# EasyEDA Pro project bitMan_Schematic_2025-12-16.epro

# Schematic Top
Board Name: Board1; Create Date: 2025-11-07; Page Name: Top; Project Name: BitTree; Schematic Name: Top; Update Date: 2025-11-18; Company: bitaggregat.de; Drawn: TR; Page Size: A4; Reviewed: TR; Version: V1.0
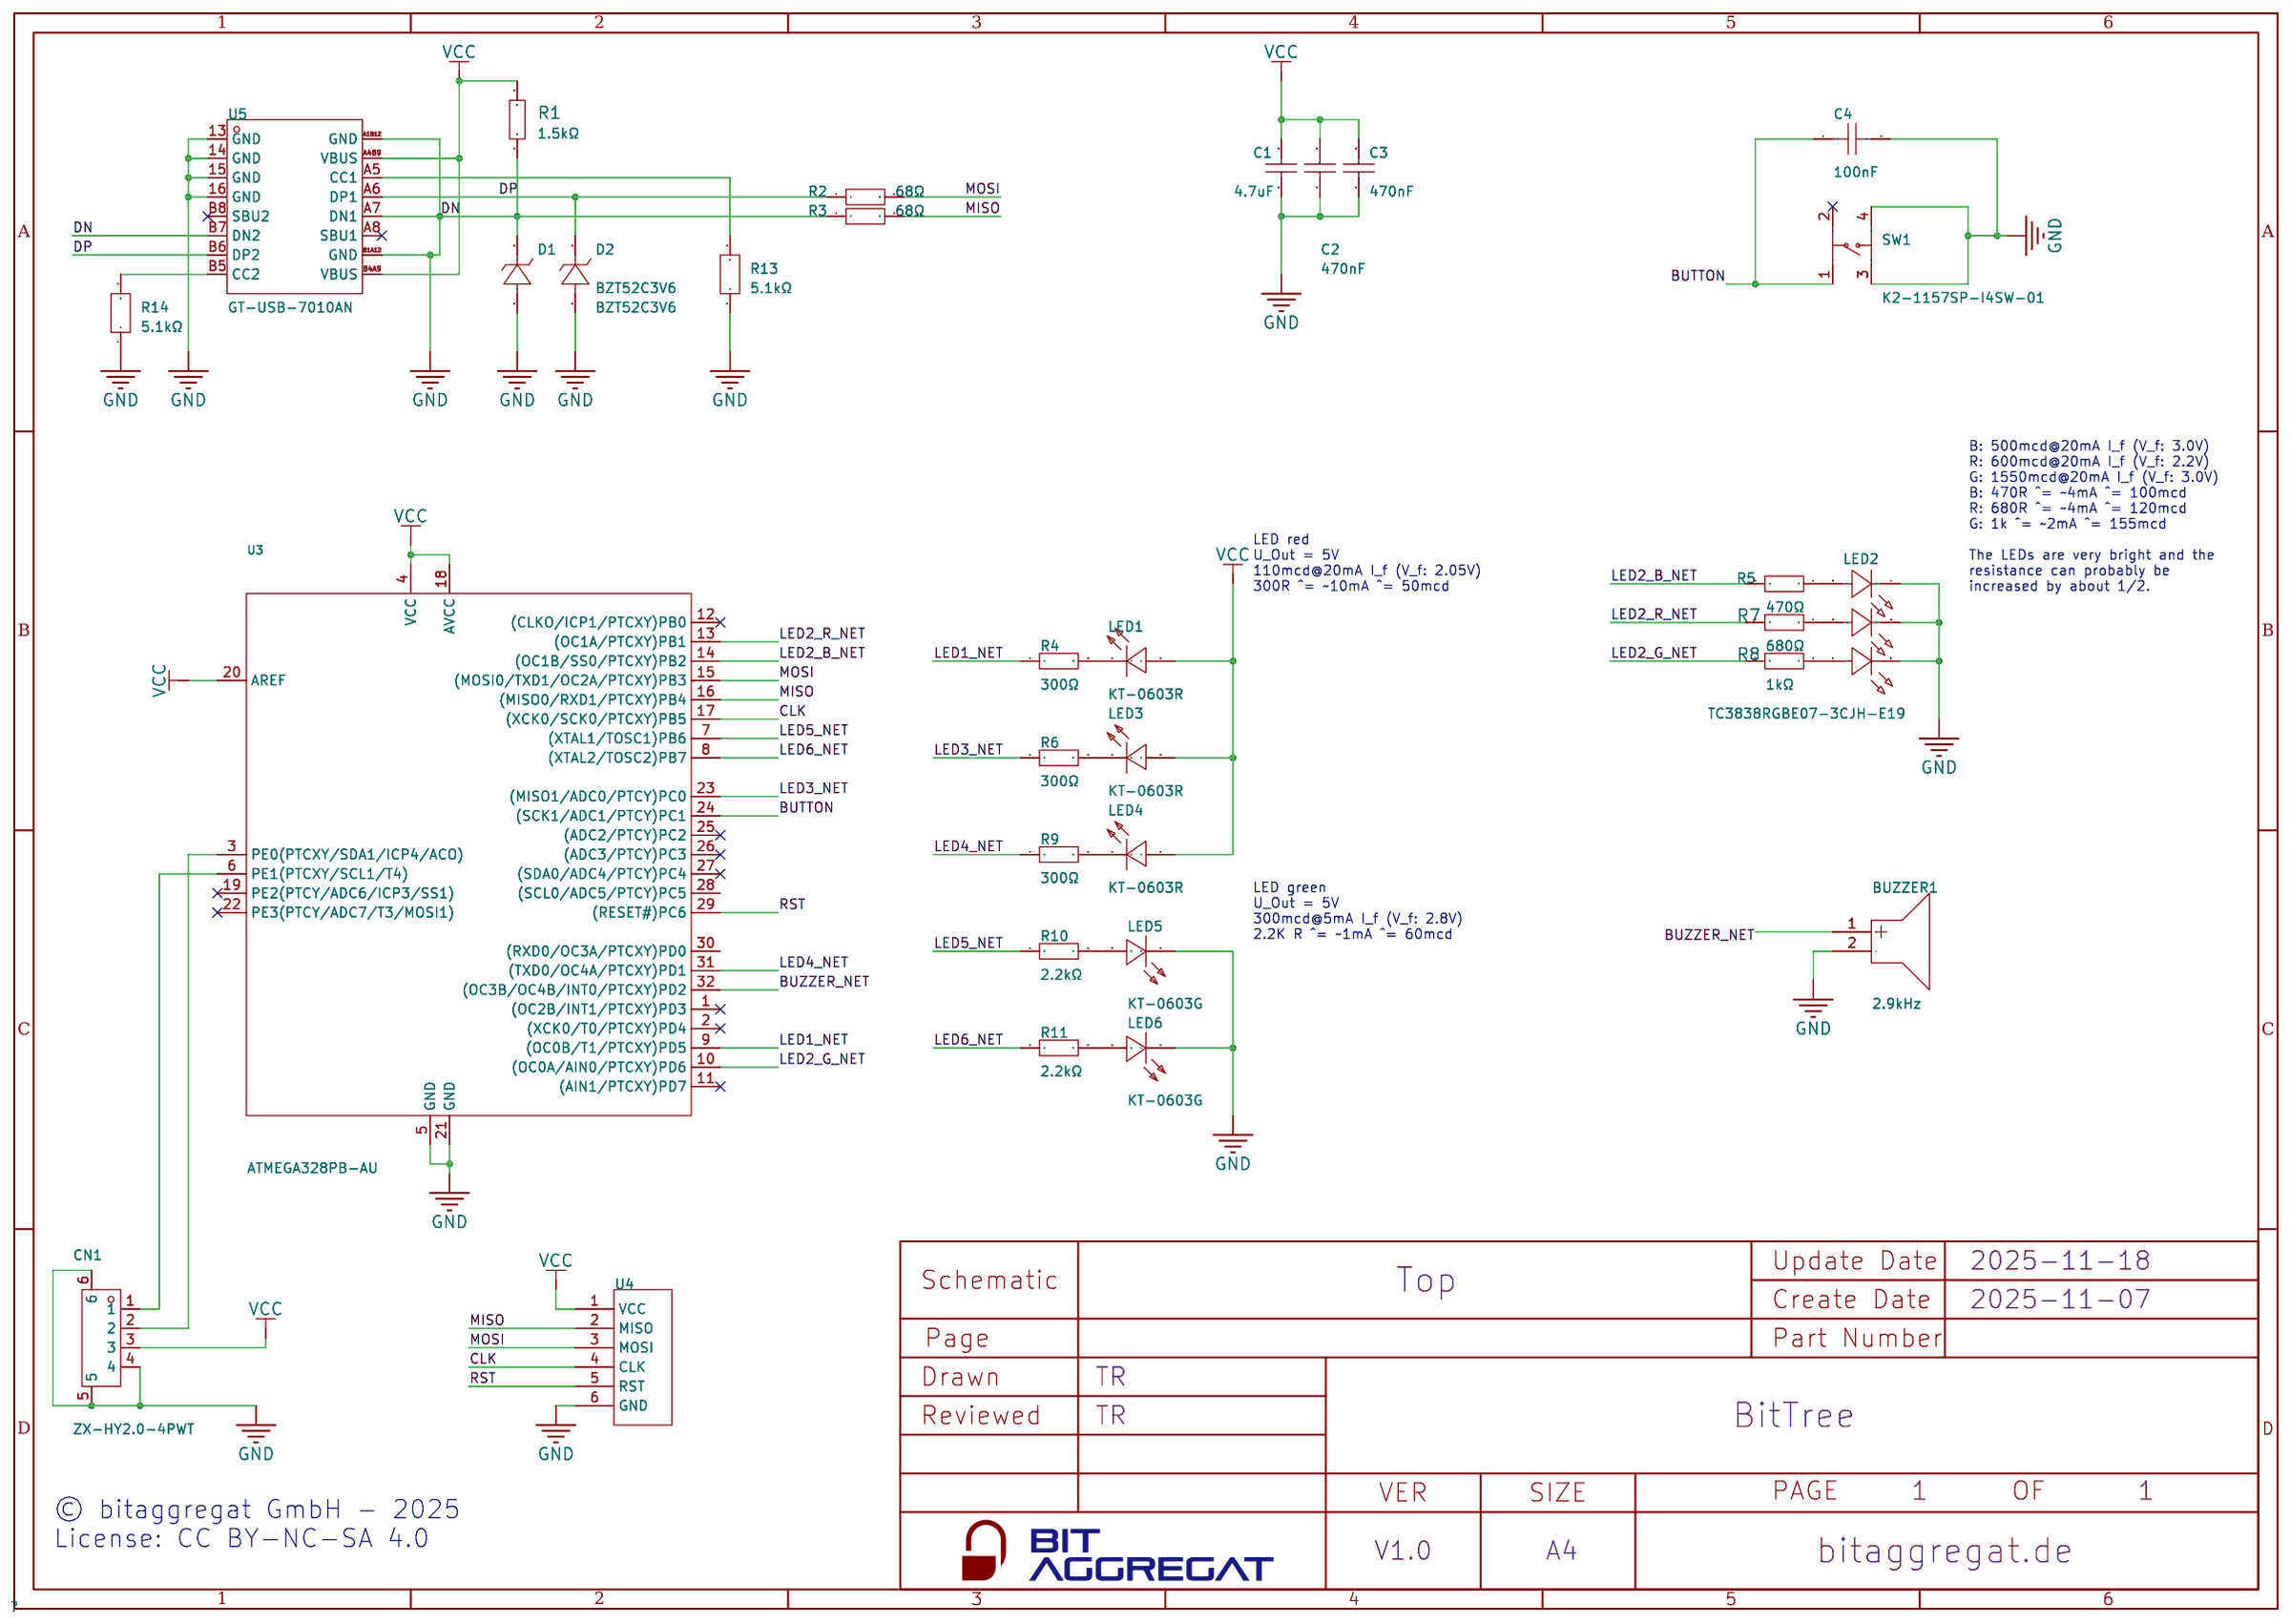
[diagram p0: schematic sheet]

## Parts
BUZZER1  2.9kHz  [BUZ-TH_BD9.0-P5.00-D0.6-L-FD]
C1  4.7uF  [C0603]
C2  470nF  [C0603]
C3  470nF  [C0603]
C4  100nF  [C0603]
CN1  ZX-HY2.0-4PWT  [CONN-SMD_4P-P2.00_ZX-HY2.0-4PWT]
D1  BZT52C3V6  [SOD-123_L2.7-W1.6-LS3.7-RD]
D2  BZT52C3V6  [SOD-123_L2.7-W1.6-LS3.7-RD]
LED1  KT-0603R  [LED0603-RD]
LED2  TC3838RGBE07-3CJH-E19  [LED-SMD_6P-L3.5-W3.5-BL]
LED3  KT-0603R  [LED0603-RD]
LED4  KT-0603R  [LED0603-RD]
LED5  KT-0603G  [LED0603-RD]
LED6  KT-0603G  [LED0603-RD]
R1  1.5kΩ  [R0603]
R2  68Ω  [R0603]
R3  68Ω  [R0603]
R4  300Ω  [R0603]
R5  470Ω  [R0603]
R6  300Ω  [R0603]
R7  680Ω  [R0603]
R8  1kΩ  [R0603]
R9  300Ω  [R0603]
R10  2.2kΩ  [R0603]
R11  2.2kΩ  [R0603]
R13  5.1kΩ  [R0603]
R14  5.1kΩ  [R0603]
SW1  K2-1157SP-I4SW-01  [SW-SMD_4P-L6.2-W6.2-P4.50-LS8.6]
U3  ATMEGA328PB-AU  [TQFP-32_L7.0-W7.0-P0.80-LS9.0-BL]
U4  -  [ProgrammingHeader]  (no BOM)
U5  GT-USB-7010AN  [USB-SMD_GT-USB-7010AN]

## Library data of the parts
BUZZER1 = Cy-9055-5029: Oscillator Circuit:有源(内含驱动线路) Technology Type:电磁式 Operating Voltage:4V~7V Operating Voltage:4V~7V Frequency:2.9kHz Sound Pressure Level (SPL):85dB@5V,10cm Diameter (φD):9mm Height:6mm; LCSC Part Name: 电磁式有源蜂鸣器; Supplier Part: C200211; Manufacturer: CY(超音); Supplier Footprint: 插件,D=9mm; JLCPCB Part Class: Extended Part; Datasheet: https://atta.szlcsc.com/upload/public/pdf/source/20180420/C200211_A81316451996AD52A4D9A06CCBA2DFC8.pdf; Supplier: LCSC; Oscillator Circuit: 有源(内含驱动线路); Technology Type: 电磁式; Operating Voltage: 4V~7V; Sound Pressure Level (SPL): 85dB@5V,10cm; Diameter (φD): 9mm; Height: 6mm
C1 = CL10A475KO8NNNC: Capacitance: Tolerance:±10% Tolerance:±10% Voltage Rated: Temperature Coefficient:; LCSC Part Name: 4.7uF ±10% 16V; Supplier Part: C19666; Manufacturer: SAMSUNG(三星); Supplier Footprint: 0603; JLCPCB Part Class: Basic Part; Datasheet: https://atta.szlcsc.com/upload/public/pdf/source/20160218/1457707763339.pdf; Supplier: LCSC; Tolerance: ±10%
C2 C3 = CL10B474KA8NNNC: Capacitance: Tolerance:±10% Tolerance:±10% Voltage Rated: Temperature Coefficient:; LCSC Part Name: 470nF ±10% 25V; Supplier Part: C1623; Manufacturer: SAMSUNG(三星); Supplier Footprint: 0603; JLCPCB Part Class: Basic Part; Datasheet: https://atta.szlcsc.com/upload/public/pdf/source/20160218/1457707763339.pdf; Supplier: LCSC; Tolerance: ±10%
C4 = CC0603KRX7R9BB104: Capacitance:100nF Tolerance:±10% Tolerance:±10% Voltage Rating:50V Temperature Coefficient:X7R; LCSC Part Name: 100nF ±10% 50V; Supplier Part: C14663; Manufacturer: YAGEO(国巨); Supplier Footprint: 0603; JLCPCB Part Class: Basic Part; Datasheet: https://item.szlcsc.com/datasheet/CC0603KRX7R9BB104/15331.html; Supplier: LCSC; Tolerance: ±10%; Voltage Rating: 50V; Temperature Coefficient: X7R
CN1 = ZX-HY2.0-4PWT: Pins Structure:1x4P Pitch:2mm Mounting Type:Surface Mount, Right Angle Reference Series:HY Number of Pins:4P Number of Rows:1 Number of PINs Per Row:4 Row Spacing:- Current Rating:2A Contact Material:Brass Contact Plating:Tin Operating Temperature:-25℃~+8; LCSC Part Name: 1x4P 间距:2mm 卧贴 系列:HY; Supplier Part: C7429571; Manufacturer: Megastar(兆星); Supplier Footprint: SMD,P=2mm,卧贴; JLCPCB Part Class: Extended Part; Datasheet: https://item.szlcsc.com/datasheet/ZX-HY2.0-4PWT/8427488.html; Supplier: LCSC; Pins Structure: 1x4P; Pitch: 2mm; Mounting Type: Surface Mount, Right Angle; Reference Series: HY; Number of Pins: 4P; Number of Rows: 1; Number of PINs Per Row: 4; Current Rating: 2A; Contact Material: Brass; Contact Plating: Tin; Operating Temperature: -25℃~+85℃; Supplementary Features: Auxiliary Solder Pin; Color: Beige; Z-Height of the Board: 5.2mm; X-Length of Bottom Edge on Board (Spacing Line): 12mm; Y-Width of Bottom Edge on Board: 10.5mm
D1 D2 = BZT52C3V6_C19077397: Diode Configuration:Independent Zener Voltage(Nom):3.6V Reverse Leakage Current (Ir):5uA@1.0V Zener Voltage(Range):3.42V~3.78V Zener Voltage(Range):3.42V~3.78V Pd - Power Dissipation:350mW Impedance(Zzt):90Ω Impedance(Zzk):600Ω Operating Junction Temperat; LCSC Part Name: 表面贴装齐纳二极管; Supplier Part: C19077397; Manufacturer: R+O(宏嘉诚); Supplier Footprint: SOD-123; JLCPCB Part Class: Extended Part; Datasheet: https://item.szlcsc.com/datasheet/BZT52C3V6/20275482.html; Supplier: LCSC; Diode Configuration: Independent; Zener Voltage (Nom): 3.6V; Reverse Leakage Current (Ir): 5uA@1.0V; Zener Voltage (Range): 3.42V~3.78V; Power Dissipation: 500mW; Zener Impedance (Zzt): 90Ω; Zener Voltage(Nom): 3.6V; Zener Voltage(Range): 3.42V~3.78V; Pd - Power Dissipation: 350mW; Impedance(Zzt): 90Ω; Impedance(Zzk): 600Ω; Operating Junction Temperature Range: -55℃~+150℃
LED1 LED3 LED4 = KT-0603R: Emitted Color:Red Power Dissipation:- Forward Current:- Dominant Wavelength:- Dominant Wavelength:- Peak Wavelength:- Diode Configuration:- Lens Color:- Color Temperature:- Color Temperature:- Viewing Angle:- Mounting Sytle:- Operating Temperature:-40℃~+8; LCSC Part Name: 0603 红灯 高亮; Supplier Part: C2286; Manufacturer: KENTO; Supplier Footprint: 0603; JLCPCB Part Class: Basic Part; Datasheet: https://atta.szlcsc.com/upload/public/pdf/source/20160616/1466072038404.pdf; Supplier: LCSC; Emitted Color: Red; Operating Temperature: -40℃~+85℃
LED2 = TC3838RGBE07-3CJH-E19: LCSC Part Name: RGB三色; Supplier Part: C784547; Manufacturer: TCWIN(天成); Supplier Footprint: SMD3535; JLCPCB Part Class: Extended Part; Datasheet: https://atta.szlcsc.com/upload/public/pdf/source/20230731/32820CE5D5D80E19C372DEF700D68815.pdf; Supplier: LCSC
LED5 LED6 = KT-0603G: Illumination Color:Emerald Green Voltage - Forward(Vf):3.1V Voltage - Forward(Vf):3.1V Power(Watts):100mW Forward Current:5mA Wavelength - Dominant:513nm~528nm Wavelength - Dominant:513nm~528nm Peak Wavelength:525nm Lens Color:Water Clear Luminous Intensi; LCSC Part Name: 0603 翠绿 高亮; Supplier Part: C12624; Manufacturer: KENTO; Supplier Footprint: 0603; JLCPCB Part Class: Extended Part; Datasheet: https://item.szlcsc.com/datasheet/KT-0603G/13258.html; Supplier: LCSC; Illumination Color: Emerald Green; Voltage - Forward(Vf): 3.1V; Power(Watts): 100mW; Forward Current: 5mA; Wavelength - Dominant: 513nm~528nm; Peak Wavelength: 525nm; Lens Color: Water Clear; Luminous Intensity: 430mcd; Viewing Angle: 120°; Operating Temperature: -40℃~+85℃
R1 = 0603WAF1501T5E: Type:Thick Film Resistors Resistance:1.5kΩ Tolerance:±1% Tolerance:±1% Power(Watts): Overload Voltage (Max): Temperature Coefficient:±100ppm/℃ Temperature Coefficient:±100ppm/℃ Operating Temperature Range:-55℃~+155℃ Operating Temperature Range:-55℃~+155℃; LCSC Part Name: 1.5kΩ ±1% 100mW 厚膜电阻; Supplier Part: C22843; Manufacturer: UNI-ROYAL(厚声); Supplier Footprint: 0603; JLCPCB Part Class: Basic Part; Datasheet: https://atta.szlcsc.com/upload/public/pdf/source/20200306/C422600_1E6D84923E4A46A82E41ADD87F860B5C.pdf; Supplier: LCSC; Type: Thick Film Resistors; Tolerance: ±1%; Temperature Coefficient: ±100ppm/℃; Operating Temperature Range: -55℃~+155℃
R2 R3 = 0603WAF680JT5E: Type:Thick Film Resistors Resistance:68Ω Tolerance:±1% Tolerance:±1% Power(Watts): Overload Voltage (Max): Temperature Coefficient:±100ppm/℃ Temperature Coefficient:±100ppm/℃ Operating Temperature Range:-55℃~+155℃ Operating Temperature Range:-55℃~+155℃; LCSC Part Name: 68Ω ±1% 100mW 厚膜电阻; Supplier Part: C27592; Manufacturer: UNI-ROYAL(厚声); Supplier Footprint: 0603; JLCPCB Part Class: Extended Part; Datasheet: https://atta.szlcsc.com/upload/public/pdf/source/20200306/C422600_1E6D84923E4A46A82E41ADD87F860B5C.pdf; Supplier: LCSC; Type: Thick Film Resistors; Tolerance: ±1%; Temperature Coefficient: ±100ppm/℃; Operating Temperature Range: -55℃~+155℃
R4 R6 R9 = 0603WAF3000T5E: Type:Thick Film Resistor Resistance:300Ω Tolerance:±1% Tolerance:±1% Power(Watts):100mW Voltage-Supply(Max):75V Temperature Coefficient:±100ppm/℃ Temperature Coefficient:±100ppm/℃ Operating Temperature:-55℃~+155℃ Operating Temperature:-55℃~+155℃; LCSC Part Name: 300Ω ±1% 100mW 厚膜电阻; Supplier Part: C23025; Manufacturer: UNI-ROYAL(厚声); Supplier Footprint: 0603; JLCPCB Part Class: Basic Part; Datasheet: https://item.szlcsc.com/datasheet/0603WAF3000T5E/23752.html; Supplier: LCSC; Type: Thick Film Resistor; Tolerance: ±1%; Power(Watts): 100mW; Voltage-Supply(Max): 75V; Temperature Coefficient: ±100ppm/℃; Operating Temperature: -55℃~+155℃
R5 = 0603WAF4700T5E: Type:Thick Film Resistors Resistance: Tolerance:±1% Tolerance:±1% Power(Watts): Overload Voltage (Max): Temperature Coefficient:±100ppm/℃ Temperature Coefficient:±100ppm/℃ Operating Temperature Range:-55℃~+155℃ Operating Temperature Range:-55℃~+155℃; LCSC Part Name: 470Ω ±1% 100mW 厚膜电阻; Supplier Part: C23179; Manufacturer: UNI-ROYAL(厚声); Supplier Footprint: 0603; JLCPCB Part Class: Basic Part; Datasheet: https://atta.szlcsc.com/upload/public/pdf/source/20200306/C422600_1E6D84923E4A46A82E41ADD87F860B5C.pdf; Supplier: LCSC; Type: Thick Film Resistors; Tolerance: ±1%; Temperature Coefficient: ±100ppm/℃; Operating Temperature Range: -55℃~+155℃
R7 = 0603WAF6800T5E: Type:Thick Film Resistors Resistance: Tolerance:±1% Tolerance:±1% Power(Watts): Overload Voltage (Max): Temperature Coefficient:±100ppm/℃ Temperature Coefficient:±100ppm/℃ Operating Temperature Range:-55℃~+155℃ Operating Temperature Range:-55℃~+155℃; LCSC Part Name: 680Ω ±1% 100mW 厚膜电阻; Supplier Part: C23228; Manufacturer: UNI-ROYAL(厚声); Supplier Footprint: 0603; JLCPCB Part Class: Basic Part; Datasheet: https://atta.szlcsc.com/upload/public/pdf/source/20200306/C422600_1E6D84923E4A46A82E41ADD87F860B5C.pdf; Supplier: LCSC; Type: Thick Film Resistors; Tolerance: ±1%; Temperature Coefficient: ±100ppm/℃; Operating Temperature Range: -55℃~+155℃
R8 = 0603WAF1001T5E: Type:Thick Film Resistors Resistance:1kΩ Tolerance:±1% Tolerance:±1% Power(Watts): Overload Voltage (Max): Temperature Coefficient:±100ppm/℃ Temperature Coefficient:±100ppm/℃ Operating Temperature Range:-55℃~+155℃ Operating Temperature Range:-55℃~+155℃; LCSC Part Name: 1kΩ ±1% 100mW 厚膜电阻; Supplier Part: C21190; Manufacturer: UNI-ROYAL(厚声); Supplier Footprint: 0603; JLCPCB Part Class: Basic Part; Datasheet: https://atta.szlcsc.com/upload/public/pdf/source/20200306/C422600_1E6D84923E4A46A82E41ADD87F860B5C.pdf; Supplier: LCSC; Type: Thick Film Resistors; Tolerance: ±1%; Temperature Coefficient: ±100ppm/℃; Operating Temperature Range: -55℃~+155℃
R10 R11 = 0603WAF2201T5E_C4190: Type:Thick Film Resistors Resistance:2.2kΩ Tolerance:±1% Tolerance:±1% Power(Watts): Overload Voltage (Max): Temperature Coefficient:±100ppm/℃ Temperature Coefficient:±100ppm/℃ Operating Temperature Range:-55℃~+155℃ Operating Temperature Range:-55℃~+155℃; LCSC Part Name: 2.2kΩ ±1% 100mW 厚膜电阻; Supplier Part: C4190; Manufacturer: UNI-ROYAL(厚声); Manufacturer Part: 0603WAF2201T5E; Supplier Footprint: 0603; JLCPCB Part Class: Basic Part; Datasheet: https://atta.szlcsc.com/upload/public/pdf/source/20200306/C422600_1E6D84923E4A46A82E41ADD87F860B5C.pdf; Supplier: LCSC; Type: Thick Film Resistors; Tolerance: ±1%; Temperature Coefficient: ±100ppm/℃; Operating Temperature Range: -55℃~+155℃
R13 R14 = FRC0603F5101TS: Type:Thick Film Resistor Resistance:5.1kΩ Tolerance:±1% Tolerance:±1% Power(Watts):100mW Voltage-Supply(Max):75V Temperature Coefficient:±100ppm/℃ Temperature Coefficient:±100ppm/℃ Operating Temperature:-55℃~+155℃ Operating Temperature:-55℃~+155℃; LCSC Part Name: 5.1kΩ ±1% 100mW 厚膜电阻; Supplier Part: C2907044; Manufacturer: FOJAN(富捷); Supplier Footprint: 0603; JLCPCB Part Class: Extended Part; Supplier: LCSC; Type: Thick Film Resistor; Tolerance: ±1%; Power(Watts): 100mW; Voltage-Supply(Max): 75V; Temperature Coefficient: ±100ppm/℃; Operating Temperature: -55℃~+155℃
SW1 = K2-1157SP-I4SW-01: Circuit:- Self Lock / No Lock:- Actuator Style:Round Button IP Rating:- Mounting Type:Surface Mount,Vertical Contact Current:50mA Voltage Rating:12V Actuator/Cap Color:Red With Lamp:Without Termination Style:Gull Wing Operating Force:2.5N Operating Temper; LCSC Part Name: 6.4x6.2x3.7红柄开关; Supplier Part: C2909692; Manufacturer: 韩国韩荣; Supplier Footprint: SMD; JLCPCB Part Class: Extended Part; Datasheet: https://item.szlcsc.com/datasheet/K2-1157SP-I4SW-01/3187750.html; Supplier: LCSC; Actuator Style: Round Button; Mounting Type: Surface Mount,Vertical; Contact Current: 50mA; Voltage Rating: 12V; Actuator/Cap Color: Red; With Lamp: Without; Termination Style: Gull Wing; Operating Force: 2.5N; Operating Temperature: -25℃~+80℃; Life: 100,000 Cycles
U3 = ATMEGA328PB-AU: CPU Core:AVR CPU Maximum Speed:20MHz Program Storage Size:32KB Program Memory Type:FLASH Number of I/O:27 ADC (Bit):10bit Voltage - Supply:1.8V~5.5V Voltage - Supply:1.8V~5.5V Applications:-; Supplier Part: C132230; Manufacturer: MICROCHIP(美国微芯); Supplier Footprint: TQFP-32(7x7); JLCPCB Part Class: Extended Part; Datasheet: https://item.szlcsc.com/datasheet/ATMEGA328PB-AU/143529.html; Supplier: LCSC; CPU Core: AVR; CPU Maximum Speed: 20MHz; Program Storage Size: 32KB; Program Memory Type: FLASH; Number of I/O: 27; ADC (Bit): 10bit; Voltage - Supply: 1.8V~5.5V
U4 = ProgrammingHeader
U5 = GT-USB-7010AN: Connector Type:Type-C Standard:USB 2.0 Gender:Female Mounting Style:卧贴 Number of Contacts:16P Number of Ports:1 Current Rating - Power (Max):5A Contact Material:高导铜 Contact Plating:Gold Operating Temperature Range:-40℃~+85℃ Operating Temperature Range:-40; LCSC Part Name: Type-C 母 卧贴 黑色; Supplier Part: C963370; Manufacturer: G-Switch(品赞); Supplier Footprint: SMD; JLCPCB Part Class: Extended Part; Datasheet: https://atta.szlcsc.com/upload/public/pdf/source/20231219/A53A193191E7DF39BB7DE19828A2E6A3.pdf; Supplier: LCSC; Connector Type: Type-C; Standard: USB 2.0; Gender: Female; Mounting Style: 卧贴; Number of Contacts: 16P; Number of Ports: 1; Current Rating - Power (Max): 5A; Contact Material: 高导铜; Contact Plating: Gold; Operating Temperature Range: -40℃~+85℃

## Nets
GND: BUZZER1.2(-) C1.1 C2.1 C3.1 C4.2 CN1.4 CN1.5 CN1.6 D1.2(A) D2.2(A) LED2.4(-) LED2.5(-) LED2.6(-) LED5.1(K) LED6.1(K) R13.1 R14.1 SW1.3 SW1.4 U3.5(GND) U3.21(GND) U4.6(GND) U5.13(GND) U5.14(GND) U5.15(GND) U5.16(GND) U5.A1B12(GND) U5.B1A12(GND)
VCC: C1.2 C2.2 C3.2 CN1.3 LED1.2(A) LED3.2(A) LED4.2(A) R1.2 U3.4(VCC) U3.18(AVCC) U3.20(AREF) U4.1(VCC) U5.A4B9(VBUS) U5.B4A9(VBUS)
BUTTON: C4.1 SW1.1 U3.24((SCK1/ADC1/PTCY)PC1)
BUZZER_NET: BUZZER1.1(+) U3.32((OC3B/OC4B/INT0/PTCXY)PD2)
CLK: U3.17((XCK0/SCK0/PTCXY)PB5) U4.4(CLK)
DN: D1.1(K) R1.1 R3.1 U5.A7(DN1) U5.B7(DN2)
DP: D2.1(K) R2.1 U5.A6(DP1) U5.B6(DP2)
LED1_NET: R4.1 U3.9((OC0B/T1/PTCXY)PD5)
LED2_B_NET: R5.2 U3.14((OC1B/SS0/PTCXY)PB2)
LED2_G_NET: R8.2 U3.10((OC0A/AIN0/PTCXY)PD6)
LED2_R_NET: R7.2 U3.13((OC1A/PTCXY)PB1)
LED3_NET: R6.1 U3.23((MISO1/ADC0/PTCY)PC0)
LED4_NET: R9.1 U3.31((TXD0/OC4A/PTCXY)PD1)
LED5_NET: R10.1 U3.7((XTAL1/TOSC1)PB6)
LED6_NET: R11.1 U3.8((XTAL2/TOSC2)PB7)
MISO: R3.2 U3.16((MISO0/RXD1/PTCXY)PB4) U4.2(MISO)
MOSI: R2.2 U3.15((MOSI0/TXD1/OC2A/PTCXY)PB3) U4.3(MOSI)
RST: U3.29((RESET#)PC6) U4.5(RST)
Net-(CN1-1): CN1.1 U3.6(PE1(PTCXY/SCL1/T4))
Net-(CN1-2): CN1.2 U3.3(PE0(PTCXY/SDA1/ICP4/ACO))
Net-(LED1-1): LED1.1(K) R4.2
Net-(LED2-1): LED2.1(+) R8.1
Net-(LED2-2): LED2.2(+) R7.1
Net-(LED2-3): LED2.3(+) R5.1
Net-(LED3-1): LED3.1(K) R6.2
Net-(LED4-1): LED4.1(K) R9.2
Net-(LED5-2): LED5.2(A) R10.2
Net-(LED6-2): LED6.2(A) R11.2
Net-(R13-2): R13.2 U5.A5(CC1)
Net-(R14-2): R14.2 U5.B5(CC2)

Not connected (* = marked no-connect by the designer): SW1 2*; U3 1((OC2B/INT1/PTCXY)PD3)* 2((XCK0/T0/PTCXY)PD4)* 11((AIN1/PTCXY)PD7)* 12((CLKO/ICP1/PTCXY)PB0)* 19(PE2(PTCY/ADC6/ICP3/SS1))* 22(PE3(PTCY/ADC7/T3/MOSI1))* 25((ADC2/PTCY)PC2)* 26((ADC3/PTCY)PC3)* 27((SDA0/ADC4/PTCY)PC4)* 28((SCL0/ADC5/PTCY)PC5) 30((RXD0/OC3A/PTCXY)PD0); U5 A8(SBU1)* B8(SBU2)*

## Notes on the sheet
- LED red
  U_Out = 5V
  110mcd@20mA I_f (V_f: 2.05V)
  300R ^= ~10mA ^= 50mcd
- B: 500mcd@20mA I_f (V_f: 3.0V)
  R: 600mcd@20mA I_f (V_f: 2.2V)
  G: 1550mcd@20mA I_f (V_f: 3.0V)
  B: 470R ^= ~4mA ^= 100mcd
  R: 680R ^= ~4mA ^= 120mcd
  G: 1k ^= ~2mA ^= 155mcd
  The LEDs are very bright and the
  resistance can probably be
  increased by about 1/2.
- LED green
  U_Out = 5V
  300mcd@5mA I_f (V_f: 2.8V)
  2.2K R ^= ~1mA ^= 60mcd
- © bitaggregat GmbH - 2025
  License: CC BY-NC-SA 4.0
